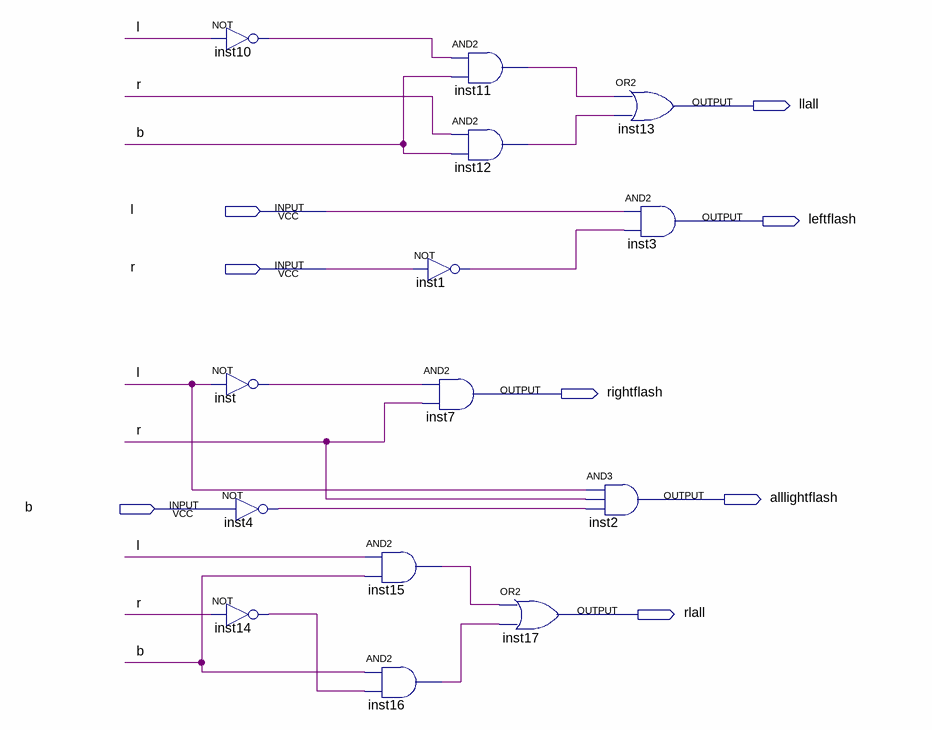
[diagram p0: schematic sheet]
// Quartus schematic toggle.bdf as structural Verilog: 14 symbols, 8 pins
module toggle (
  input  l,
  input  r,
  input  b,
  output llall,
  output leftflash,
  output rightflash,
  output alllightflash,
  output rlall
);

  wire inst1_out, inst4_out, inst10_out, inst11_out, inst12_out, inst14_out, inst15_out, inst16_out, inst_out;

  not inst10 (inst10_out, l);
  not inst (inst_out, l);
  not inst4 (inst4_out, b);
  not inst14 (inst14_out, r);
  not inst1 (inst1_out, r);
  and inst7 (rightflash, inst_out, r);
  and inst15 (inst15_out, l, b);
  and inst16 (inst16_out, b, inst14_out);
  and inst11 (inst11_out, inst10_out, b);
  and inst12 (inst12_out, r, b);
  or inst17 (rlall, inst15_out, inst16_out);
  or inst13 (llall, inst11_out, inst12_out);
  and inst3 (leftflash, l, inst1_out);
  and inst2 (alllightflash, l, r, inst4_out);
endmodule
